# Altium schematic sheet CON_RS485_PWR_RJ45.SchDoc: CAN Connector DB9 Male
size A4; Organization: Altium Limited.; Address1: Level 3, 12a Rodborough Rd; Address2: Frenchs Forest 2086; Address3: NSW; Address4: AUSTRALIA; SheetNumber: 1; SheetTotal: 100
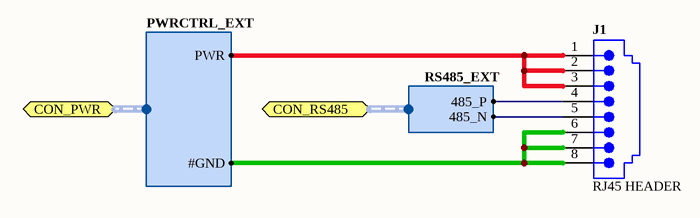
[diagram p0: CON_RS485_PWR_RJ45.SchDoc]

## Parts
J1  RJ45 HEADER  [15-43-6233]

## Ports
CON_PWR (harness PWRCTRL_EXT), CON_RS485 (harness RS485_EXT)

## Harnesses
RS485_EXT: 485_P, 485_N
PWRCTRL_EXT: PWR, #GND

## Nets
NetJ1_1: J1.1 J1.2 J1.3 ; port CON_PWR.PWR
NetJ1_4: J1.4 ; port CON_RS485.485_P
NetJ1_5: J1.5 ; port CON_RS485.485_N
NetJ1_6: J1.6 J1.7 J1.8 ; port CON_PWR.#GND

## Notes on the sheet
- Sheet Title
- Project Title
- Size:
- Date:
- A4
- Assy:
- Time:
- Revision:
- Sheet
- of
- File:

## Library data of the parts
J1 = D-300-0005: Connector, RJ45 Socket, Right-Angle, 8 Way (Ethernet), PCM8P8C; Category: Connector; Connector type: RJ45 HEADER; Status: Production